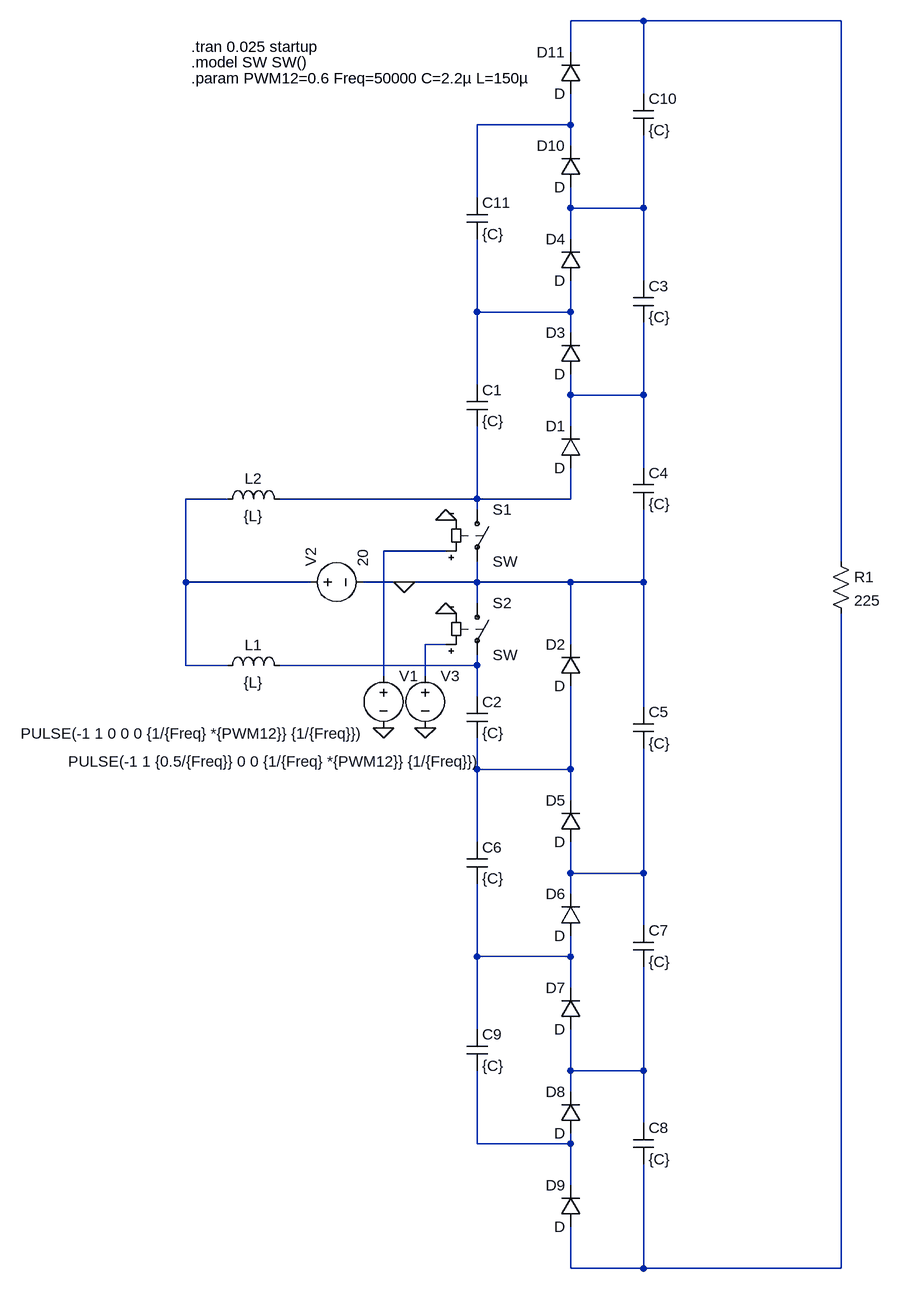
[diagram p0: schematic 3Nx.asc]
3Nx.asc, the LTspice schematic file:
Version 4
SHEET 1 1520 2040
WIRE 704 112 592 112
WIRE 1008 112 704 112
WIRE 592 160 592 112
WIRE 704 224 704 112
WIRE 592 272 592 224
WIRE 592 272 448 272
WIRE 592 304 592 272
WIRE 448 384 448 272
WIRE 592 400 592 368
WIRE 704 400 704 288
WIRE 704 400 592 400
WIRE 592 448 592 400
WIRE 704 512 704 400
WIRE 448 560 448 448
WIRE 592 560 592 512
WIRE 592 560 448 560
WIRE 592 592 592 560
WIRE 448 672 448 560
WIRE 592 688 592 656
WIRE 704 688 704 576
WIRE 704 688 592 688
WIRE 592 736 592 688
WIRE 704 800 704 688
WIRE 64 848 0 848
WIRE 448 848 448 736
WIRE 448 848 144 848
WIRE 592 848 592 800
WIRE 592 848 448 848
WIRE 448 864 448 848
WIRE 400 928 304 928
WIRE 1008 944 1008 112
WIRE 0 976 0 848
WIRE 192 976 0 976
WIRE 336 976 272 976
WIRE 448 976 448 944
WIRE 448 976 336 976
WIRE 592 976 448 976
WIRE 704 976 704 864
WIRE 704 976 592 976
WIRE 448 1008 448 976
WIRE 400 1072 368 1072
WIRE 592 1072 592 976
WIRE 0 1104 0 976
WIRE 64 1104 0 1104
WIRE 448 1104 448 1088
WIRE 448 1104 144 1104
WIRE 304 1120 304 928
WIRE 368 1120 368 1072
WIRE 448 1152 448 1104
WIRE 704 1168 704 976
WIRE 448 1264 448 1216
WIRE 592 1264 592 1136
WIRE 592 1264 448 1264
WIRE 592 1312 592 1264
WIRE 448 1376 448 1264
WIRE 592 1424 592 1376
WIRE 704 1424 704 1232
WIRE 704 1424 592 1424
WIRE 592 1456 592 1424
WIRE 704 1504 704 1424
WIRE 448 1552 448 1440
WIRE 592 1552 592 1520
WIRE 592 1552 448 1552
WIRE 592 1600 592 1552
WIRE 448 1664 448 1552
WIRE 592 1728 592 1664
WIRE 704 1728 704 1568
WIRE 704 1728 592 1728
WIRE 592 1760 592 1728
WIRE 704 1808 704 1728
WIRE 448 1840 448 1728
WIRE 592 1840 592 1824
WIRE 592 1840 448 1840
WIRE 592 1904 592 1840
WIRE 592 2032 592 1968
WIRE 704 2032 704 1872
WIRE 704 2032 592 2032
WIRE 1008 2032 1008 1024
WIRE 1008 2032 704 2032
FLAG 400 1024 0
FLAG 400 880 0
FLAG 336 976 0
FLAG 304 1200 0
FLAG 368 1200 0
SYMBOL voltage 176 976 R270
WINDOW 123 0 0 Left 2
WINDOW 39 0 0 Left 2
SYMATTR InstName V2
SYMATTR Value 20
SYMBOL sw 448 848 R0
SYMATTR InstName S1
SYMBOL sw 448 992 R0
SYMATTR InstName S2
SYMBOL ind 48 1120 R270
WINDOW 0 32 56 VTop 2
WINDOW 3 5 56 VBottom 2
SYMATTR InstName L1
SYMATTR Value {L}
SYMBOL ind 48 864 R270
WINDOW 0 32 56 VTop 2
WINDOW 3 5 56 VBottom 2
SYMATTR InstName L2
SYMATTR Value {L}
SYMBOL cap 432 672 R0
SYMATTR InstName C1
SYMATTR Value {C}
SYMBOL cap 432 1152 R0
SYMATTR InstName C2
SYMATTR Value {C}
SYMBOL cap 688 800 R0
SYMATTR InstName C4
SYMATTR Value {C}
SYMBOL cap 688 1168 R0
SYMATTR InstName C5
SYMATTR Value {C}
SYMBOL diode 608 800 R180
WINDOW 0 24 64 Left 2
WINDOW 3 24 0 Left 2
SYMATTR InstName D1
SYMBOL diode 608 656 R180
WINDOW 0 24 64 Left 2
WINDOW 3 24 0 Left 2
SYMATTR InstName D3
SYMBOL cap 688 512 R0
SYMATTR InstName C3
SYMATTR Value {C}
SYMBOL diode 608 1376 R180
WINDOW 0 24 64 Left 2
WINDOW 3 24 0 Left 2
SYMATTR InstName D5
SYMBOL diode 608 1520 R180
WINDOW 0 24 64 Left 2
WINDOW 3 24 0 Left 2
SYMATTR InstName D6
SYMBOL diode 608 1664 R180
WINDOW 0 24 64 Left 2
WINDOW 3 24 0 Left 2
SYMATTR InstName D7
SYMBOL cap 432 1376 R0
SYMATTR InstName C6
SYMATTR Value {C}
SYMBOL cap 688 1504 R0
SYMATTR InstName C7
SYMATTR Value {C}
SYMBOL res 992 928 R0
SYMATTR InstName R1
SYMATTR Value 225
SYMBOL voltage 304 1104 R0
WINDOW 3 -558 105 Left 2
WINDOW 123 0 0 Left 2
WINDOW 39 0 0 Left 2
SYMATTR Value PULSE(-1 1 0 0 0 {1/{Freq} *{PWM12}} {1/{Freq}})
SYMATTR InstName V1
SYMBOL voltage 368 1104 R0
WINDOW 3 -549 148 Left 2
WINDOW 123 0 0 Left 2
WINDOW 39 0 0 Left 2
SYMATTR Value PULSE(-1 1 {0.5/{Freq}} 0 0 {1/{Freq} *{PWM12}} {1/{Freq}})
SYMATTR InstName V3
SYMBOL diode 608 1824 R180
WINDOW 0 24 64 Left 2
WINDOW 3 24 0 Left 2
SYMATTR InstName D8
SYMBOL diode 608 1968 R180
WINDOW 0 24 64 Left 2
WINDOW 3 24 0 Left 2
SYMATTR InstName D9
SYMBOL cap 688 1808 R0
SYMATTR InstName C8
SYMATTR Value {C}
SYMBOL cap 432 1664 R0
SYMATTR InstName C9
SYMATTR Value {C}
SYMBOL diode 608 368 R180
WINDOW 0 24 64 Left 2
WINDOW 3 24 0 Left 2
SYMATTR InstName D10
SYMBOL diode 608 224 R180
WINDOW 0 24 64 Left 2
WINDOW 3 24 0 Left 2
SYMATTR InstName D11
SYMBOL cap 688 224 R0
SYMATTR InstName C10
SYMATTR Value {C}
SYMBOL cap 432 384 R0
SYMATTR InstName C11
SYMATTR Value {C}
SYMBOL diode 608 512 R180
WINDOW 0 24 64 Left 2
WINDOW 3 24 0 Left 2
SYMATTR InstName D4
SYMBOL diode 608 1136 R180
WINDOW 0 24 64 Left 2
WINDOW 3 24 0 Left 2
SYMATTR InstName D2
TEXT 8 152 Left 2 !.tran 0.025 startup
TEXT 8 176 Left 2 !.model SW SW()
TEXT 8 200 Left 2 !.param PWM12=0.6 Freq=50000 C=2.2µ L=150µ

The netlist it stands for:
* 3Nx.asc
V2 N006 0 20
S1 N007 0 N008 0 SW
S2 0 N010 N009 0 SW
L1 N006 N010 {L}
L2 N006 N007 {L}
C1 N004 N007 {C}
C2 N010 N011 {C}
C4 N005 0 {C}
C5 0 N012 {C}
D1 N007 N005 D
D3 N005 N004 D
C3 N003 N005 {C}
D5 N012 N011 D
D6 N013 N012 D
D7 N014 N013 D
C6 N011 N013 {C}
C7 N012 N014 {C}
R1 N001 N016 225
V1 N008 0 PULSE(-1 1 0 0 0 {1/{Freq} *{PWM12}} {1/{Freq}})
V3 N009 0 PULSE(-1 1 {0.5/{Freq}} 0 0 {1/{Freq} *{PWM12}} {1/{Freq}})
D8 N015 N014 D
D9 N016 N015 D
C8 N014 N016 {C}
C9 N013 N015 {C}
D10 N003 N002 D
D11 N002 N001 D
C10 N001 N003 {C}
C11 N002 N004 {C}
D4 N004 N003 D
D2 N011 0 D
.model D D
.lib standard.dio
.tran 0.025 startup
.model SW SW()
.param PWM12=0.6 Freq=50000 C=2.2µ L=150µ
.backanno
.end